# EAGLE design Tilty Omni (EAGLE 6.5.0)
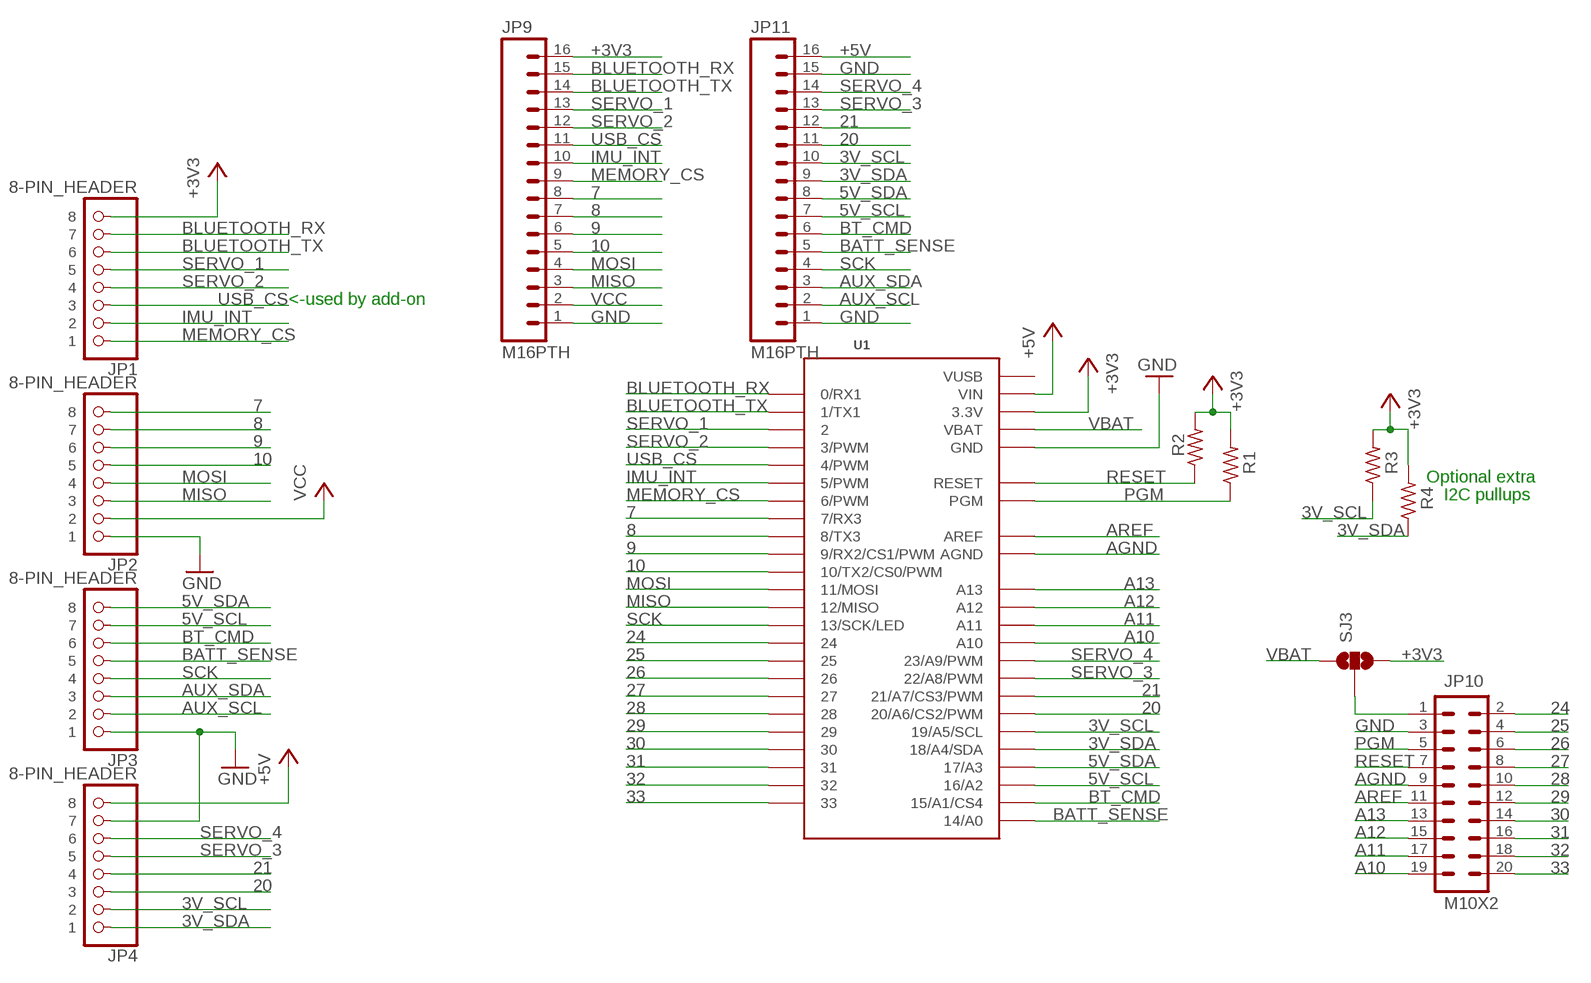
[diagram p0: schematic, sheet 1]

## Parts
JP1  8-PIN_HEADER  [8-PIN_RECEPTACLE_LOCK_NO-SS]
JP2  8-PIN_HEADER  [8-PIN_RECEPTACLE_LOCK_NO-SS]
JP3  8-PIN_HEADER  [8-PIN_RECEPTACLE_LOCK_NO-SS]
JP4  8-PIN_HEADER  [8-PIN_RECEPTACLE_LOCK_NO-SS]
JP9  M16PTH  [1X16]
JP10  M10X2  [2X10]
JP11  M16PTH  [1X16]
R1  10k  R-US_R0603  [R0603]
R2  10k  R-US_R0603  [R0603]
R3  10k  R-US_R0603  [R0603]
R4  10k  R-US_R0603  [R0603]
SJ3  SOLDERJUMPER_2WAYPASTE2&3  [SJ_3_PASTE2&3]
U1  TEENSY_3.0_ALLPINS  [TEENSY_3.0_ALLPINS]

## Nets
3V_SCL: JP4.P$2 JP11.10 R3.1 U1.19/A5(19/A5/SCL)
3V_SDA: JP4.P$1 JP11.9 R4.1 U1.18/A4(18/A4/SDA)
5V_SCL: JP3.P$7 JP11.7 U1.16/A2
5V_SDA: JP3.P$8 JP11.8 U1.17/A3
7: JP2.P$8 JP9.8 U1.7(7/RX3)
8: JP2.P$7 JP9.7 U1.8(8/TX3)
9: JP2.P$6 JP9.6 U1.9(9/RX2/CS1/PWM)
10: JP2.P$5 JP9.5 U1.10(10/TX2/CS0/PWM)
20: JP4.P$3 JP11.11 U1.20/A6(20/A6/CS2/PWM)
21: JP4.P$4 JP11.12 U1.21/A7(21/A7/CS3/PWM)
24: JP10.2 U1.24
25: JP10.4 U1.25
26: JP10.6 U1.26
27: JP10.8 U1.27
28: JP10.10 U1.28
29: JP10.12 U1.29
30: JP10.14 U1.30
31: JP10.16 U1.31
32: JP10.18 U1.32
33: JP10.20 U1.33
+3V3: JP1.P$8 JP9.16 R1.2 R2.2 R3.2 R4.2 SJ3.3 U1.3.3V U1.3.3V1(3.3V) U1.3.3V2(3.3V)
+5V: JP4.P$8 JP11.16 U1.VIN
A10: JP10.19 U1.A10
A11: JP10.17 U1.A11
A12: JP10.15 U1.A12
A13: JP10.13 U1.A13
AGND: JP10.9 U1.AGND
AREF: JP10.11 U1.AREF
AUX_SCL: JP3.P$2 JP11.2
AUX_SDA: JP3.P$3 JP11.3
BATT_SENSE: JP3.P$5 JP11.5 U1.14/A0
BLUETOOTH_RX: JP1.P$7 JP9.15 U1.0(0/RX1)
BLUETOOTH_TX: JP1.P$6 JP9.14 U1.1(1/TX1)
BT_CMD: JP3.P$6 JP11.6 U1.15/A1(15/A1/CS4)
GND: JP2.P$1 JP3.P$1 JP4.P$7 JP9.1 JP10.3 JP11.1 JP11.15 U1.GND U1.GND1(GND) U1.GND2(GND)
IMU_INT: JP1.P$2 JP9.10 U1.5(5/PWM)
MEMORY_CS: JP1.P$1 JP9.9 U1.6(6/PWM)
MISO: JP2.P$3 JP9.3 U1.12(12/MISO)
MOSI: JP2.P$4 JP9.4 U1.11(11/MOSI)
N$2: JP10.1 SJ3.2
PGM: JP10.5 R1.1 U1.PGM
RESET: JP10.7 R2.1 U1.RESET
SCK: JP3.P$4 JP11.4 U1.13(13/SCK/LED)
SERVO_1: JP1.P$5 JP9.13 U1.2
SERVO_2: JP1.P$4 JP9.12 U1.3(3/PWM)
SERVO_3: JP4.P$5 JP11.13 U1.22/A8(22/A8/PWM)
SERVO_4: JP4.P$6 JP11.14 U1.23/A9(23/A9/PWM)
USB_CS: JP1.P$3 JP9.11 U1.4(4/PWM)
VBAT: SJ3.1 U1.VBAT
VCC: JP2.P$2 JP9.2

## Notes on the sheet
- <-used by add-on
- Optional extra
- I2C pullups

## Power pins joined to a net without a drawn wire
VUSB: U1.VUSB

## Library data of the parts
JP1-JP4 = My Parts:8-PIN_HEADER
JP9 JP11 = SparkFun-Connectors:M16: 1x16 .1" header
JP10 = SparkFun-Connectors:M10X2: This was SPECIALLY designed to be used with our Graphic LCD Backpack. Be sure you want to use this! It is not only staggered on each line of header holes, but IT IS ALSO offset of the center point of the top and bottom lines by 5 mil. This causes the headers to lock into place on the "standard" footprint on the LCD screen. The extra squares on the tdocu layer are there simply to reference other pins (if you were to actually populate a longer header than ten long - this is what we do with the backpacks).
R1-R4 = resistor:R-US_: RESISTOR, American symbol
SJ3 = SparkFun-Passives:SOLDERJUMPER_2WAY: Solder Jumper 2 way solder jumper
U1 = Teensy3.0:TEENSY_3.0_ALLPINS: Teensy 3.0 with all pin holes and optional SMD-mount unshrouded header on bottom of Teensy 3.0. For more basic versions, see 'Basic', '+4' and 'AllAnalogPins'. Requires the installation of a un-shrouded SMD header on the underside of the Teensy 3.0

## Board
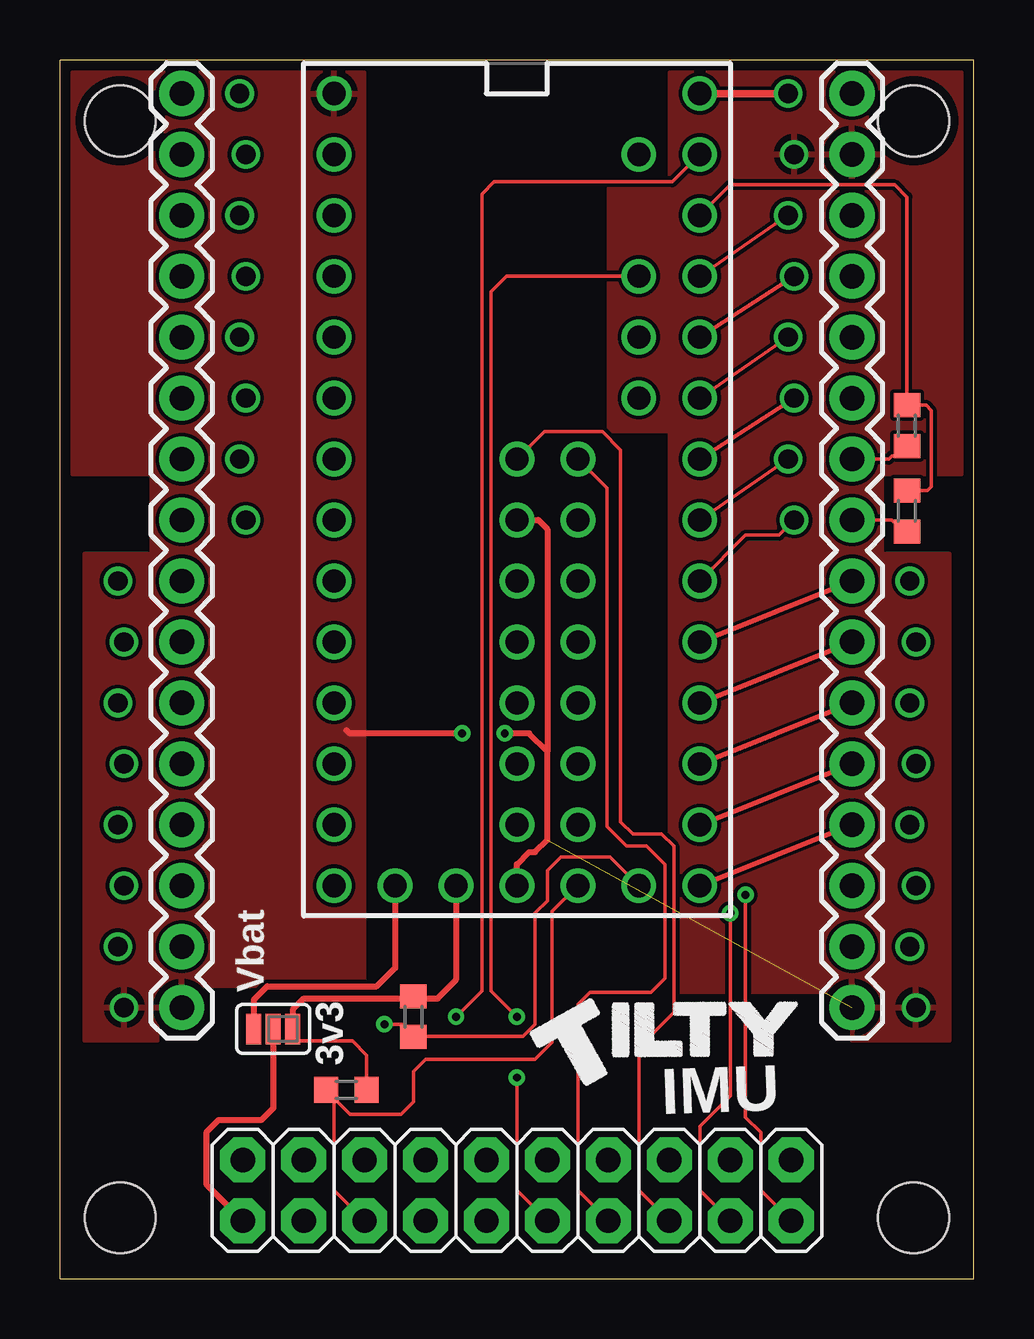
[diagram p1: board, top side]
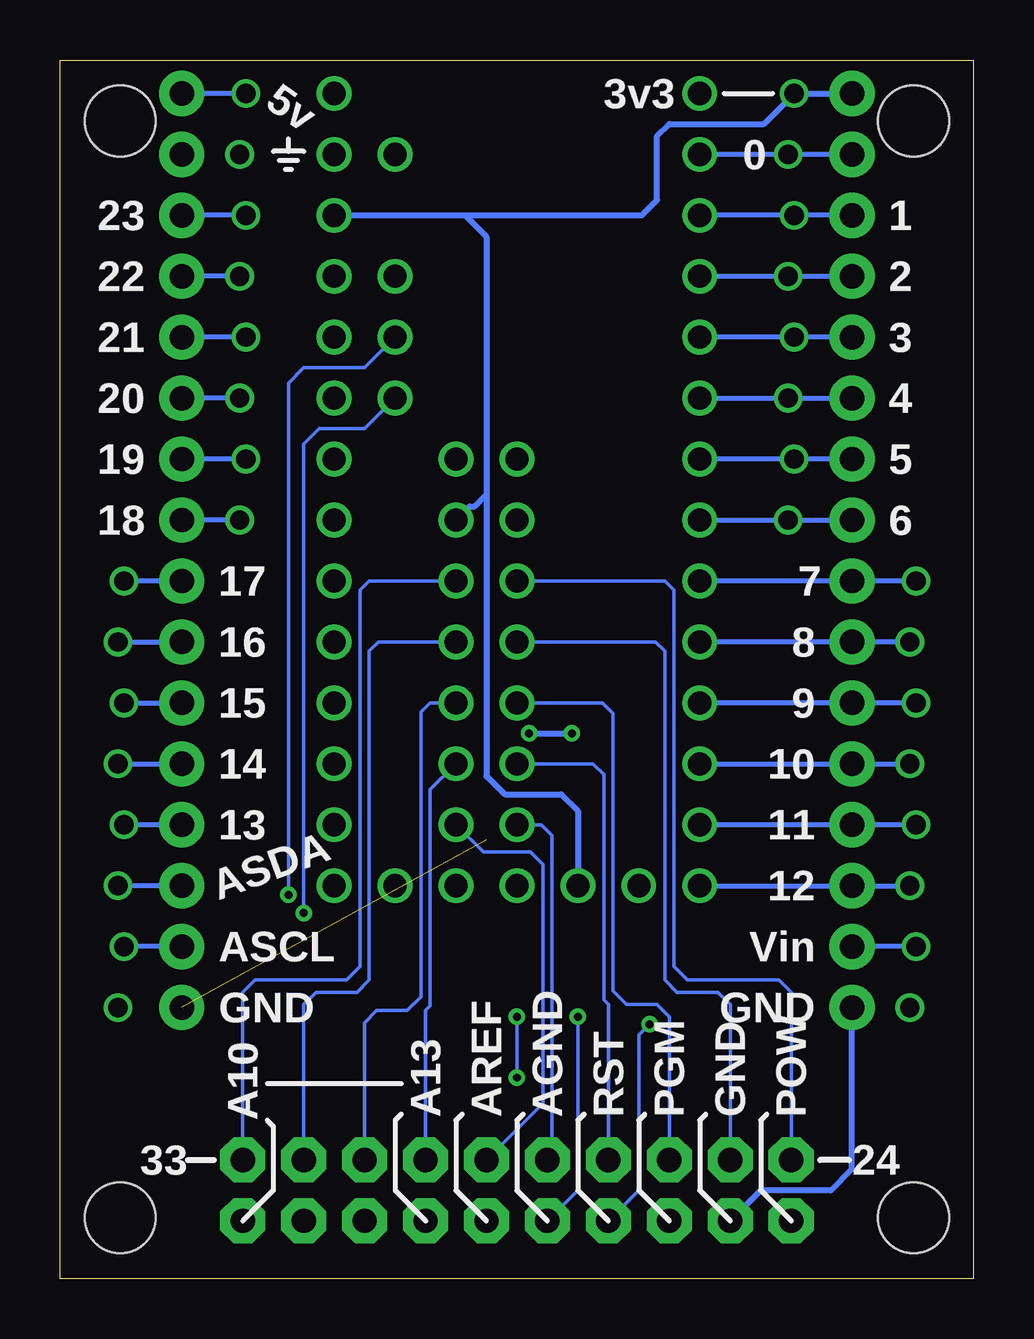
[diagram p2: board, bottom side, seen from below]

Size 38.1 x 50.8 mm. Coordinates in mm from the lower left corner, seen from the top.
Outline: 0,0 38.1,0 38.1,50.8 0,50.8 0,0
Copper layers (1*16): Top 0.0356mm / dielectric 1.5011mm / Bottom 0.0356mm
Design rules "LaenPCBOrder *": minimum track width 6mil, minimum drill 13mil, track to track 6mil, track to pad 6mil, pad to pad 6mil, via to via 6mil, smd to smd 6mil, copper to edge 15mil, drill to drill 6mil, minimum pad ring 7mil, minimum via ring 7mil, stop-mask expansion 4mil, vias tented up to drill 15mil, thermal gap 10mil
Holes 2.95 mm at 35.59,48.26 35.59,2.54 2.51,2.54 2.51,48.26

### Footprints (pad centres in the part's own frame; a part is rotated, then mirrored left to right if it is on the bottom)
8-PIN_RECEPTACLE_LOCK_NO-SS = drill 0.8: P$1 -8.89,-0.127; P$2 -6.35,0.127; P$3 -3.81,-0.127; P$4 -1.27,0.127; P$5 1.27,-0.127; P$6 3.81,0.127; P$7 6.35,-0.127; P$8 8.89,0.127
1X16 = drill 1.016 pad 1.88: 1 0,0; 2 2.54,0; 3 5.08,0; 4 7.62,0; 5 10.16,0; 6 12.7,0; 7 15.24,0; 8 17.78,0; 9 20.32,0; 10 22.86,0; 11 25.4,0; 12 27.94,0; 13 30.48,0; 14 33.02,0; 15 35.56,0; 16 38.1,0
2X10 = drill 1.016 pad 1.88 octagon: 1 -11.43,-1.27; 2 -11.43,1.27; 3 -8.89,-1.27; 4 -8.89,1.27; 5 -6.35,-1.27; 6 -6.35,1.27; 7 -3.81,-1.27; 8 -3.81,1.27; 9 -1.27,-1.27; 10 -1.27,1.27; 11 1.27,-1.27; 12 1.27,1.27; 13 3.81,-1.27; 14 3.81,1.27; 15 6.35,-1.27; 16 6.35,1.27; 17 8.89,-1.27; 18 8.89,1.27; 19 11.43,-1.27; 20 11.43,1.27
R0603 = smd 1 x 1.1: 1 -0.85,0; 2 0.85,0
SJ_3_PASTE2&3 = smd 0.635 x 1.27: 1 -0.813,0; 2 0,0; 3 0.813,0
TEENSY_3.0_ALLPINS = drill 0.965: 0 -7.62,13.97; 1 -7.62,11.43; 2 -7.62,8.89; 3 -7.62,6.35; 3.3V 7.62,11.43; 3.3V1 -2.54,-16.51; 3.3V2 2.54,-1.27; 4 -7.62,3.81; 5 -7.62,1.27; 6 -7.62,-1.27; 7 -7.62,-3.81; 8 -7.62,-6.35; 9 -7.62,-8.89; 10 -7.62,-11.43; 11 -7.62,-13.97; 12 -7.62,-16.51; 13 7.62,-16.51; 14/A0 7.62,-13.97; 15/A1 7.62,-11.43; 16/A2 7.62,-8.89; 17/A3 7.62,-6.35; 18/A4 7.62,-3.81; 19/A5 7.62,-1.27; 20/A6 7.62,1.27; 21/A7 7.62,3.81; 22/A8 7.62,6.35; 23/A9 7.62,8.89; 24 0,-3.81; 25 0,-6.35; 26 0,-8.89; 27 0,-11.43; 28 0,-13.97; 29 2.54,-13.97; 30 2.54,-11.43; 31 2.54,-8.89; 32 2.54,-6.35; 33 2.54,-3.81; A10 5.08,6.35; A11 5.08,3.81; A12 0,1.27; A13 2.54,1.27; AGND 7.62,13.97; AREF 5.08,8.89; GND -7.62,16.51; GND1 0,-16.51; GND2 0,-1.27; PGM 2.54,-16.51; RESET 5.08,-16.51; VBAT -5.08,-16.51; VIN 7.62,16.51; VUSB 5.08,13.97

### Placement (x,y rotation side)
JP1  7.62,40.51 90 top
JP2  2.54,20.19 90 top
JP3  35.56,20.19 90 top
JP4  30.48,40.51 90 top
JP9  5.08,11.3 90 top
JP10  19.05,3.68 0 top
JP11  33.02,11.3 90 top
R1  11.94,7.87 0 top
R2  14.73,10.92 90 top
R3  35.31,35.56 90 top
R4  35.31,32 90 top
SJ3  8.89,10.41 0 top
U1  19.05,32.89 0 top

### Tracks (layer width: path | path; a pad name or v marks a point on that pad's centre or on a via)
3V_SCL
  Top 0.152: U1.19/A5 JP4.P$2 | R3.1 35.22,34.71 34.8,34.29 34.67,34.29 34.54,34.16 JP11.10
  Bottom 0.203: JP4.P$2 JP11.10
3V_SDA
  Top 0.152: U1.18/A4 28.57,30.99 29.97,30.99 JP4.P$1 | R4.1 35.27,31.15 34.86,31.56 34.73,31.56 34.67,31.62 JP11.9
  Bottom 0.203: JP4.P$1 JP11.9
5V_SCL
  Top 0.203: U1.16/A2 JP11.7
  Bottom 0.203: JP3.P$7 JP11.7
5V_SDA
  Top 0.203: U1.17/A3 JP11.8
  Bottom 0.203: JP11.8 JP3.P$8
7
  Bottom 0.203: JP2.P$8 JP9.8 U1.7
8
  Bottom 0.203: JP2.P$7 JP9.7 U1.8
9
  Bottom 0.203: JP2.P$6 JP9.6 U1.9
10
  Bottom 0.203: U1.10 JP9.5 JP2.P$5
20
  Top 0.152: U1.20/A6 JP4.P$3
  Bottom 0.203: JP4.P$3 JP11.11
21
  Top 0.152: U1.21/A7 JP4.P$4
  Bottom 0.203: JP4.P$4 JP11.12
24
  Bottom 0.152: U1.24 12.89,29.08 12.51,28.7 12.51,13.02 11.94,12.45 8.13,12.45 7.62,11.94 JP10.2
25
  Bottom 0.152: U1.25 13.27,26.54 12.89,26.16 12.89,12.45 12.38,11.94 10.67,11.94 10.16,11.43 JP10.4
26
  Bottom 0.152: U1.26 15.49,24 15.05,23.56 15.05,12 14.48,11.43 13.21,11.43 12.7,10.92 JP10.6
27
  Bottom 0.152: U1.27 15.88,21.46 15.43,21.02 15.43,11.62 15.24,11.43 JP10.8
28
  Bottom 0.152: U1.28 18.03,18.92 17.59,18.48 17.59,5.14 JP10.10
29
  Bottom 0.152: U1.29 20.45,17.78 18.48,17.78 17.97,17.27 17.97,7.3 JP10.12
30
  Bottom 0.152: U1.30 22.67,20.38 22.67,11.37 22.86,11.18 JP10.14
31
  Bottom 0.152: U1.31 22.67,24 23.05,23.62 23.05,11.75 23.62,11.18 24.89,11.18 25.4,10.67 JP10.16
32
  Bottom 0.152: U1.32 24.83,26.54 25.21,26.16 25.21,12.45 25.72,11.94 27.43,11.94 27.94,11.43 JP10.18
33
  Bottom 0.152: U1.33 25.21,29.08 25.59,28.7 25.59,13.02 26.16,12.45 29.97,12.45 30.48,11.94 JP10.20
+3V3
  Top 0.152: 15.75,11.68 14.82,11.68 R2.2 | 10.16,11.68 11.77,11.68 | R1.2 12.79,9.31 12.19,9.91 9.65,9.91 9.65,10.36 SJ3.3 | R4.2 36.16,32.85 36.32,33.02 36.32,36.2 36.11,36.41 R3.2 35.31,45.09 34.8,45.59 27.94,45.59 U1.3.3V
  Top 0.254: U1.3.3V1 16.51,12.45 15.75,11.68 10.16,11.68 9.7,11.23 SJ3.3
  Bottom 0.254: 20.32,32.7 20.32,43.43 21.21,44.32 U1.3.3V 13.84,44.32 13.21,44.96 13.21,47.62 12.7,48.13 8.76,48.13 JP1.P$8 JP9.16 | 20.32,32.7 20.32,20.95 19.56,20.19 17.21,20.19 16.51,19.49 U1.3.3V1 | U1.3.3V2 21.02,32.19 20.83,32.19 20.32,32.7
+5V
  Top 0.305: U1.VIN JP4.P$8
  Bottom 0.203: JP4.P$8 JP11.16
A10  (via drill 0.33)
  Top 0.152: v28.57,16 28.57,6.73 29.21,6.1 29.21,3.68 JP10.19
  Bottom 0.152: U1.A10 25.4,37.97 27.94,37.97 28.57,37.34 v28.57,16
A11  (via drill 0.33)
  Top 0.152: v27.94,15.24 27.94,7.62 26.67,6.35 26.67,3.68 JP10.17
  Bottom 0.152: U1.A11 25.4,35.43 27.3,35.43 27.94,34.8 v27.94,15.24
A12
  Top 0.152: U1.A12 20.19,35.31 22.61,35.31 23.37,34.54 23.37,19.05 23.88,18.54 25.08,18.54 25.59,18.03 25.59,11.11 24.13,9.65 24.13,3.68 JP10.15
A13
  Top 0.152: U1.A13 22.8,32.96 22.8,18.86 23.62,18.03 24.45,18.03 25.21,17.27 25.21,12.51 24.64,11.94 22.1,11.94 21.59,11.43 21.59,3.68 JP10.13
AGND  (via drill 0.33)
  Top 0.152: U1.AGND 25.53,45.72 18.1,45.72 17.59,45.21 17.59,12 v16.51,10.92
  Bottom 0.152: v16.51,10.92 16.51,3.68 JP10.9
AREF  (via drill 0.33)
  Top 0.152: U1.AREF 18.61,41.78 17.97,41.15 17.97,12 v19.05,10.92 | v19.05,8.38 19.05,3.68 JP10.11
  Bottom 0.152: v19.05,10.92 v19.05,8.38
AUX_SCL
  Bottom 0.203: JP11.2 JP3.P$2
AUX_SDA
  Bottom 0.203: JP11.3 JP3.P$3
BATT_SENSE
  Top 0.203: U1.14/A0 JP11.5
  Bottom 0.203: JP3.P$5 JP11.5
BLUETOOTH_RX
  Bottom 0.203: U1.0 JP1.P$7 JP9.15
BLUETOOTH_TX
  Bottom 0.203: JP9.14 JP1.P$6 U1.1
BT_CMD
  Top 0.203: U1.15/A1 JP11.6
  Bottom 0.203: JP3.P$6 JP11.6
GND  (via drill 0.33)  (1 unrouted)
  Top 0.254: U1.GND1 19.05,17.27 19.56,17.78 19.81,17.78 20.32,18.29 20.32,21.97 | 20.32,21.97 19.56,22.73 v18.54,22.73 | v16.76,22.73 12.06,22.73 11.94,22.86 | U1.GND2 19.94,31.62 20.32,31.24 20.32,21.97
  Bottom 0.254: v18.54,22.73 v16.76,22.73 | JP10.3 8.89,3.68 5.97,3.68 5.08,4.57 JP9.1
  pour Top: 12.7,30.23 3.81,30.23 3.81,33.53 0.51,33.53 0.51,50.29 12.7,50.29
  pour Top: 25.4,29.97 34.29,29.97 34.29,33.53 37.59,33.53 37.59,50.29 25.4,50.29 25.4,45.47 22.86,45.47 22.86,35.31 25.4,35.31
  pour Top: 12.7,30.23 12.7,12.19 4.06,12.19 4.06,9.91 1.02,9.91 1.02,30.23
  pour Top: 25.4,30.23 37.08,30.23 37.08,9.91 33.02,9.91 33.02,11.94 25.4,11.94
IMU_INT
  Bottom 0.203: JP9.10 JP1.P$2 U1.5
MEMORY_CS
  Bottom 0.203: U1.6 JP1.P$1 JP9.9
MISO
  Bottom 0.203: U1.12 JP9.3 JP2.P$3
MOSI
  Bottom 0.203: JP2.P$4 JP9.4 U1.11
N$2
  Top 0.254: SJ3.2 8.89,7.11 8.38,6.6 6.6,6.6 6.1,6.1 6.1,3.94 JP10.1
PGM
  Top 0.152: U1.PGM 20.51,15.3 20.51,9.84 19.81,9.14 15.24,9.14 14.73,8.64 14.73,7.37 14.22,6.86 12.1,6.86 R1.1 11.43,7.53 11.43,3.68 JP10.5
RESET  (via drill 0.33)
  Top 0.152: U1.RESET 22.92,17.59 20.89,17.59 20.32,17.02 20.32,15.75 19.81,15.24 19.81,10.6 19.3,10.1 14.76,10.1 R2.1 14.64,10.07 14.48,9.91 14.29,9.91 14.29,10.6 v13.53,10.6
  Bottom 0.152: JP10.7 13.97,3.68 13.97,10.16 v13.53,10.6
SCK
  Top 0.203: JP11.4 U1.13
  Bottom 0.203: JP11.4 JP3.P$4
SERVO_1
  Bottom 0.203: U1.2 JP1.P$5 JP9.13
SERVO_2
  Bottom 0.203: JP9.12 JP1.P$4 U1.3
SERVO_3
  Top 0.152: U1.22/A8 JP4.P$5
  Bottom 0.203: JP4.P$5 JP11.13
SERVO_4
  Top 0.152: U1.23/A9 JP4.P$6
  Bottom 0.203: JP4.P$6 JP11.14
USB_CS
  Bottom 0.203: U1.4 JP1.P$3 JP9.11
VBAT
  Top 0.254: U1.VBAT 13.97,12.95 13.21,12.19 8.64,12.19 8.08,11.63 SJ3.1
VCC
  Bottom 0.203: JP2.P$2 JP9.2

### Text on the board
tNames: Vbat | 3v3 | IMU
bNames: 5v | 3v3 | 0 | 1 | 23 | 2 | 22 | 3 | 21 | 4 | 20 | 5 | 19 | 6 | 18 | 7 | 17 | 8 | 16 | 9 | 15 | 10 | 14 | 11 | 13 | 12 | ASDA | Vin | ASCL | GND | GND | POW | GND | PGM | RST | AGND | AREF | A13 | A10 | 24 | 33